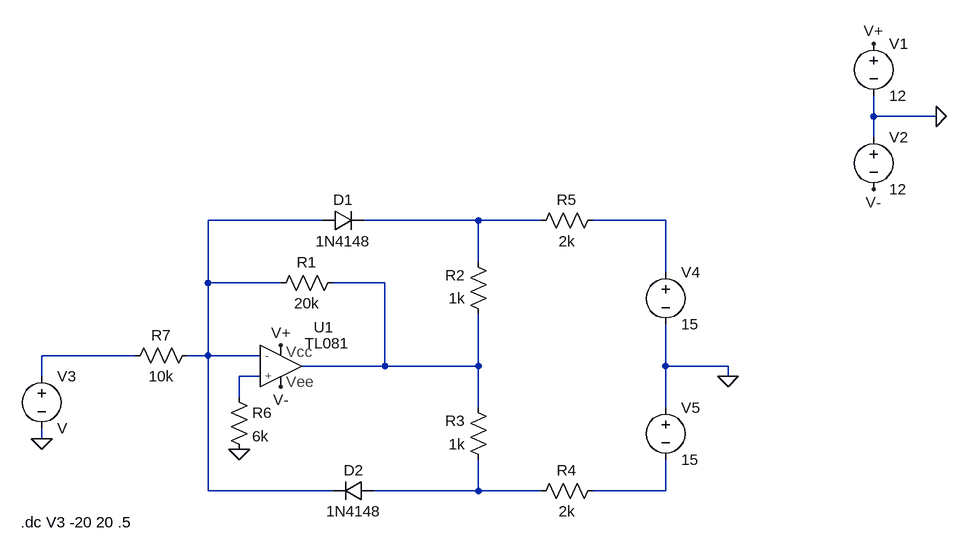
[diagram p0: schematic Limitador.asc]
Limitador.asc, the LTspice schematic file:
Version 4
SHEET 1 1076 680
WIRE -5408 -304 -5408 -336
WIRE -5312 -304 -5408 -304
WIRE -5408 -272 -5408 -304
WIRE -6256 -144 -6432 -144
WIRE -6016 -144 -6192 -144
WIRE -5920 -144 -6016 -144
WIRE -5728 -144 -5840 -144
WIRE -6016 -80 -6016 -144
WIRE -5728 -64 -5728 -144
WIRE -6432 -48 -6432 -144
WIRE -6320 -48 -6432 -48
WIRE -6160 -48 -6240 -48
WIRE -6544 64 -6688 64
WIRE -6432 64 -6432 -48
WIRE -6432 64 -6464 64
WIRE -6352 64 -6432 64
WIRE -6160 80 -6160 -48
WIRE -6160 80 -6288 80
WIRE -6016 80 -6016 0
WIRE -6016 80 -6160 80
WIRE -5728 80 -5728 16
WIRE -5632 80 -5728 80
WIRE -6688 96 -6688 64
WIRE -6352 96 -6384 96
WIRE -5632 96 -5632 80
WIRE -6384 128 -6384 96
WIRE -6016 144 -6016 80
WIRE -5728 144 -5728 80
WIRE -6688 192 -6688 176
WIRE -6432 272 -6432 64
WIRE -6240 272 -6432 272
WIRE -6016 272 -6016 224
WIRE -6016 272 -6176 272
WIRE -5920 272 -6016 272
WIRE -5728 272 -5728 224
WIRE -5728 272 -5840 272
FLAG -6320 48 V+
FLAG -6320 112 V-
FLAG -5312 -304 0
FLAG -5408 -416 V+
FLAG -5408 -192 V-
FLAG -6384 208 0
FLAG -6688 192 0
FLAG -5632 96 0
SYMBOL voltage -5408 -432 R0
SYMATTR InstName V1
SYMATTR Value 12
SYMBOL voltage -5408 -288 R0
SYMATTR InstName V2
SYMATTR Value 12
SYMBOL res -6224 -64 R90
WINDOW 0 0 56 VBottom 2
WINDOW 3 32 56 VTop 2
SYMATTR InstName R1
SYMATTR Value 20k
SYMBOL res -6000 16 R180
WINDOW 0 36 76 Left 2
WINDOW 3 36 40 Left 2
SYMATTR InstName R2
SYMATTR Value 1k
SYMBOL res -6000 240 R180
WINDOW 0 36 76 Left 2
WINDOW 3 36 40 Left 2
SYMATTR InstName R3
SYMATTR Value 1k
SYMBOL res -5936 288 R270
WINDOW 0 32 56 VTop 2
WINDOW 3 0 56 VBottom 2
SYMATTR InstName R4
SYMATTR Value 2k
SYMBOL res -5936 -128 R270
WINDOW 0 32 56 VTop 2
WINDOW 3 0 56 VBottom 2
SYMATTR InstName R5
SYMATTR Value 2k
SYMBOL res -6560 80 R270
WINDOW 0 32 56 VTop 2
WINDOW 3 0 56 VBottom 2
SYMATTR InstName R7
SYMATTR Value 10k
SYMBOL res -6400 112 R0
SYMATTR InstName R6
SYMATTR Value 6k
SYMBOL voltage -6688 80 R0
SYMATTR InstName V3
SYMBOL diode -6256 -128 R270
WINDOW 0 32 32 VTop 2
WINDOW 3 0 32 VBottom 2
SYMATTR InstName D1
SYMATTR Value 1N4148
SYMBOL diode -6176 256 R90
WINDOW 0 0 32 VBottom 2
WINDOW 3 32 32 VTop 2
SYMATTR InstName D2
SYMATTR Value 1N4148
SYMBOL voltage -5728 -80 R0
SYMATTR InstName V4
SYMATTR Value 15
SYMBOL voltage -5728 128 R0
SYMATTR InstName V5
SYMATTR Value 15
SYMBOL Agregados\\TL081 -6320 80 R0
SYMATTR InstName U1
TEXT -6720 320 Left 2 !.dc V3 -20 20 .5

The netlist it stands for:
* Limitador.asc
V1 V+ 0 12
V2 0 V- 12
R1 N004 N001 20k
R2 N004 N002 1k
R3 N007 N004 1k
R4 N007 N008 2k
R5 N002 N003 2k
R7 N005 N001 10k
R6 N006 0 6k
V3 N005 0 V
D1 N001 N002 1N4148
D2 N007 N001 1N4148
V4 N003 0 15
V5 0 N008 15
XU1 N006 N001 V+ V- N004 TL081  ; pins + - ? ? ?
.model D D
.lib standard.dio
.dc V3 -20 20 .5
.lib E:\Descargas\TL081.net
.backanno
.end